# Altium project CMTestBoard.PrjPcb (part 2 of 2)

## Sheet STM32F4.SchDoc
size Letter
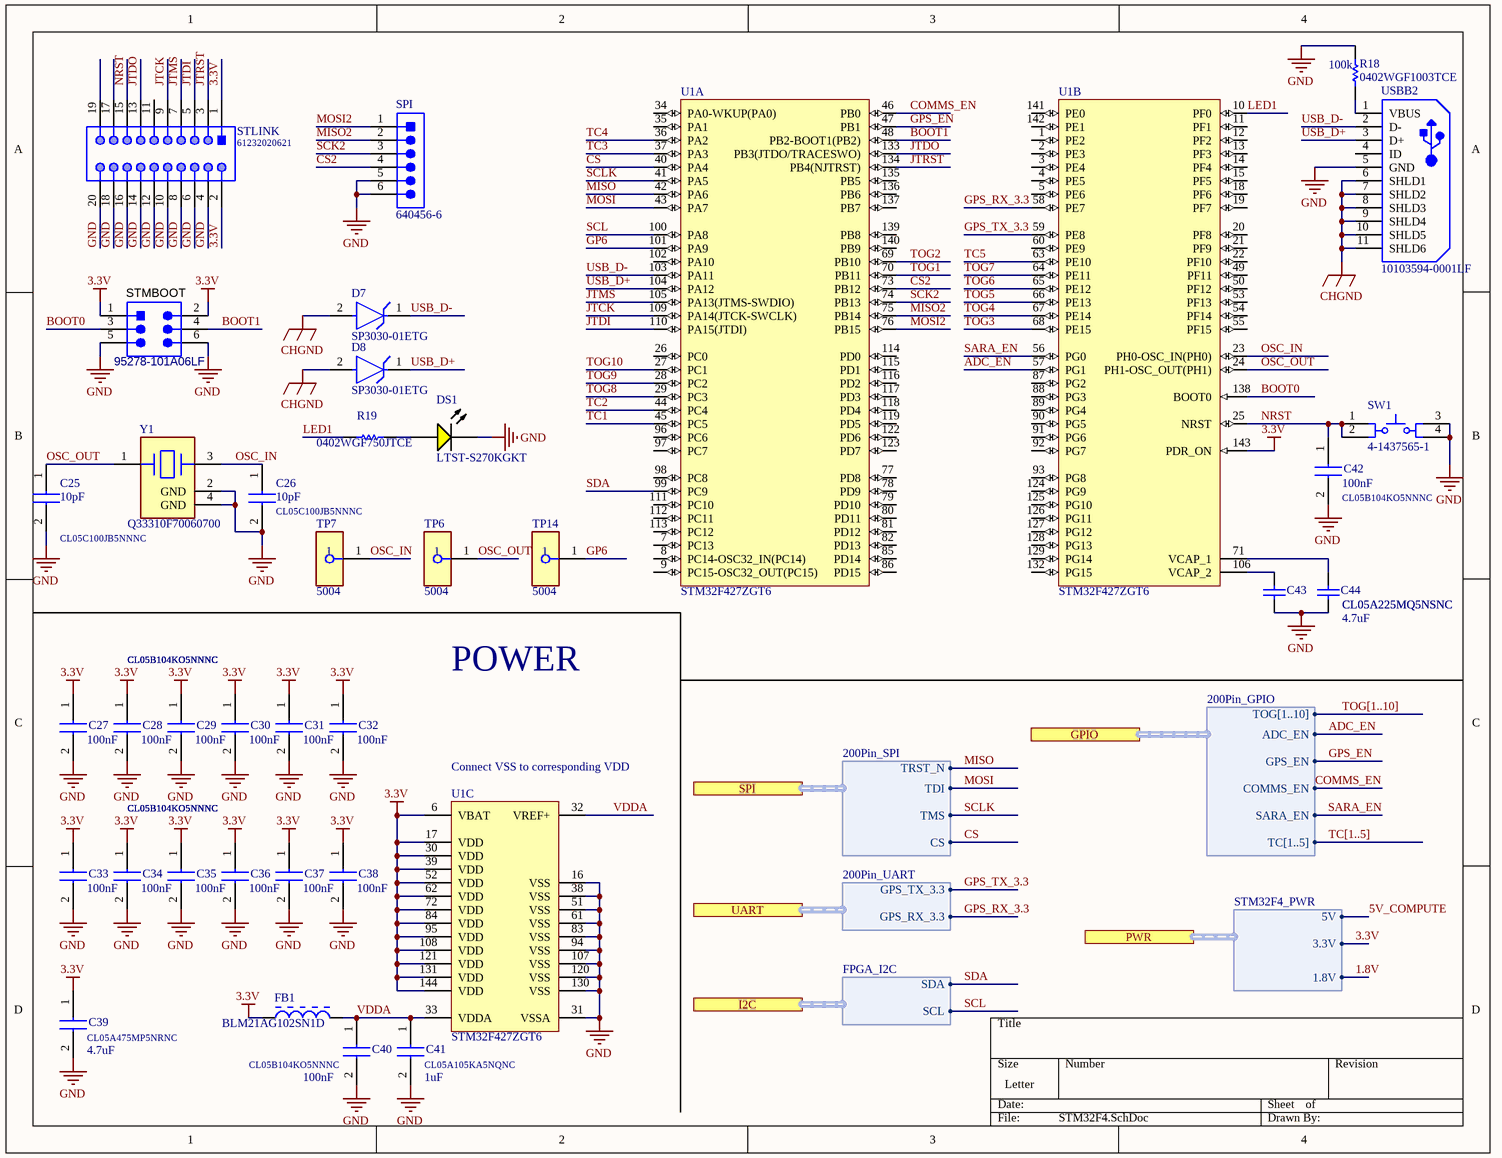
[diagram p4: STM32F4.SchDoc]

### Parts
(Parts that share a designator on the sheet are numbered #1, #2 ... from top to bottom, then left to right.)
C25#2  CL05C100JB5NNNC  value 10pF  [CAPC1005X55N]
C26#2  CL05C100JB5NNNC  value 10pF  [CAPC1005X55N]
C27#2  CL05B104KO5NNNC  value 100nF  [CAPC1005X55N]
C28#2  CL05B104KO5NNNC  value 100nF  [CAPC1005X55N]
C29  CL05B104KO5NNNC  value 100nF  [CAPC1005X55N]
C30  CL05B104KO5NNNC  value 100nF  [CAPC1005X55N]
C31  CL05B104KO5NNNC  value 100nF  [CAPC1005X55N]
C32  CL05B104KO5NNNC  value 100nF  [CAPC1005X55N]
C33  CL05B104KO5NNNC  value 100nF  [CAPC1005X55N]
C34  CL05B104KO5NNNC  value 100nF  [CAPC1005X55N]
C35  CL05B104KO5NNNC  value 100nF  [CAPC1005X55N]
C36  CL05B104KO5NNNC  value 100nF  [CAPC1005X55N]
C37  CL05B104KO5NNNC  value 100nF  [CAPC1005X55N]
C38  CL05B104KO5NNNC  value 100nF  [CAPC1005X55N]
C39  CL05A475MP5NRNC  value 4.7uF  [CAPC1005X55N]
C40  CL05B104KO5NNNC  value 100nF  [CAPC1005X55N]
C41  CL05A105KA5NQNC  value 1uF  [CAPC1005X55N]
C42  CL05B104KO5NNNC  value 100nF  [CAPC1005X55N]
C43  CL05A225MQ5NSNC  [0402]
C44  CL05A225MQ5NSNC  [0402]
D7  SP3030-01ETG  [FP-SP3030-MFG]
D8  SP3030-01ETG  [FP-SP3030-MFG]
DS1#2  LTST-S270KGKT  [AVAG-HSMX-C190_V]
FB1  BLM21AG102SN1D  [MURA-BLM21-H1-CHIP-2_V]
R18  0402WGF1003TCE  [0402]
R19  0402WGF750JTCE  [RESC1005X40X25ML05T10]
SPI  640456-6  [TECO-640456-6_V]
STLINK  61232020621  [61232020621]
STMBOOT  95278-101A06LF  [AMPM-95278-101A06LF_V]
SW1#2  4-1437565-1  [TECO-4-1437565-1_V]
TP6#2  5004  [FP-5004-MFG]
TP7#2  5004  [FP-5004-MFG]
TP14  5004  [FP-5004-MFG]
U1#2  STM32F427ZGT6  [STM-LQFP144_V]  (parts A,B,C of 3)
USBB2  10103594-0001LF  [FCI-10103594-0001LF_V]
Y1  Q33310F70060700  [FP-7M-MFG]

### Ports
GPIO (harness 200Pin_GPIO), I2C (harness FPGA_I2C), PWR (harness STM32F4_PWR), SPI (harness 200Pin_SPI), UART (harness 200Pin_UART)

### Harnesses
STM32F4_PWR: 5V, 3.3V, 1.8V
FPGA_I2C: SDA, SCL
200Pin_UART: GPS_TX_3.3, GPS_RX_3.3
200Pin_SPI: TRST_N, TDI, TMS, CS
200Pin_GPIO: TOG[1..10], ADC_EN, GPS_EN, COMMS_EN, SARA_EN, TC[1..5]

### Nets
3.3V: C27#2.1 C28#2.1 C29.1 C30.1 C31.1 C32.1 C33.1 C34.1 C35.1 C36.1 C37.1 C38.1 C39.1 FB1.1 STLINK.1 STLINK.2 STMBOOT.1 STMBOOT.2 U1#2.6(VBAT) U1#2.17(VDD) U1#2.30(VDD) U1#2.39(VDD) U1#2.52(VDD) U1#2.62(VDD) U1#2.72(VDD) U1#2.84(VDD) U1#2.95(VDD) U1#2.108(VDD) U1#2.121(VDD) U1#2.131(VDD) U1#2.143(PDR_ON) U1#2.144(VDD) ; port PWR.3.3V
CHGND: D7.2(A) D8.2(A) USBB2.6(SHLD1) USBB2.7(SHLD2) USBB2.8(SHLD3) USBB2.9(SHLD4) USBB2.10(SHLD5) USBB2.11(SHLD6)
GND: C25#2.2 C26#2.2 C27#2.2 C28#2.2 C29.2 C30.2 C31.2 C32.2 C33.2 C34.2 C35.2 C36.2 C37.2 C38.2 C39.2 C40.2 C41.2 C42.2 C43.1 C44.1 DS1#2.2(K) R18.2 SPI.5 SPI.6 STLINK.4 STLINK.6 STLINK.8 STLINK.10 STLINK.12 STLINK.14 STLINK.16 STLINK.18 STLINK.20 STMBOOT.5 STMBOOT.6 SW1#2.3 SW1#2.4 U1#2.16(VSS) U1#2.31(VSSA) U1#2.38(VSS) U1#2.51(VSS) U1#2.61(VSS) U1#2.83(VSS) U1#2.94(VSS) U1#2.107(VSS) U1#2.120(VSS) U1#2.130(VSS) USBB2.5(GND) Y1.2(GND) Y1.4(GND)
ADC_EN: U1#2.57(PG1) ; port GPIO.ADC_EN
BOOT0: STMBOOT.3 U1#2.138(BOOT0)
BOOT1: STMBOOT.4 U1#2.48(PB2-BOOT1(PB2))
COMMS_EN: U1#2.46(PB0) ; port GPIO.COMMS_EN
CS: U1#2.40(PA4) ; port SPI.CS
CS2: SPI.4 U1#2.73(PB12)
GP6: TP14.1 U1#2.101(PA9)
GPS_EN: U1#2.47(PB1) ; port GPIO.GPS_EN
GPS_RX_3.3: U1#2.58(PE7) ; port UART.GPS_RX_3.3
GPS_TX_3.3: U1#2.59(PE8) ; port UART.GPS_TX_3.3
JTCK: STLINK.9 U1#2.109(PA14(JTCK-SWCLK))
JTDI: STLINK.5 U1#2.110(PA15(JTDI))
JTDO: STLINK.13 U1#2.133(PB3(JTDO/TRACESWO))
JTMS: STLINK.7 U1#2.105(PA13(JTMS-SWDIO))
JTRST: STLINK.3 U1#2.134(PB4(NJTRST))
LED1: R19.2 U1#2.10(PF0)
MISO: U1#2.42(PA6) ; port SPI.TRST_N
MISO2: SPI.2 U1#2.75(PB14)
MOSI: U1#2.43(PA7) ; port SPI.TDI
MOSI2: SPI.1 U1#2.76(PB15)
NRST: C42.1 STLINK.15 SW1#2.1 SW1#2.2 U1#2.25(NRST)
OSC_IN: C26#2.1 TP7#2.1 U1#2.23(PH0-OSC_IN(PH0)) Y1.3
OSC_OUT: C25#2.1 TP6#2.1 U1#2.24(PH1-OSC_OUT(PH1)) Y1.1
SARA_EN: U1#2.56(PG0) ; port GPIO.SARA_EN
SCK2: SPI.3 U1#2.74(PB13)
SCL: U1#2.100(PA8) ; port I2C.SCL
SCLK: U1#2.41(PA5) ; port SPI.TMS
SDA: U1#2.99(PC9) ; port I2C.SDA
TC1: U1#2.45(PC5)
TC2: U1#2.44(PC4)
TC3: U1#2.37(PA3)
TC4: U1#2.36(PA2)
TC5: U1#2.63(PE10)
TOG1: U1#2.70(PB11)
TOG2: U1#2.69(PB10)
TOG3: U1#2.68(PE15)
TOG4: U1#2.67(PE14)
TOG5: U1#2.66(PE13)
TOG6: U1#2.65(PE12)
TOG7: U1#2.64(PE11)
TOG8: U1#2.29(PC3)
TOG9: U1#2.28(PC2)
TOG10: U1#2.27(PC1)
USB_D+: D8.1(C) U1#2.104(PA12) USBB2.3(D+)
USB_D-: D7.1(C) U1#2.103(PA11) USBB2.2(D-)
VDDA: C40.1 C41.1 FB1.2 U1#2.32(VREF+) U1#2.33(VDDA)
NetC43_2: C43.2 U1#2.106(VCAP_2)
NetC44_2: C44.2 U1#2.71(VCAP_1)
NetDS1#2_1: DS1#2.1(A) R19.1
NetR18_1: R18.1 USBB2.1(VBUS)

Not connected (* = marked no-connect by the designer): STLINK 11 17 19; U1#2 1(PE2) 2(PE3) 3(PE4) 4(PE5) 5(PE6) 7(PC13) 8(PC14-OSC32_IN(PC14)) 9(PC15-OSC32_OUT(PC15)) 11(PF1) 12(PF2) 13(PF3) 14(PF4) 15(PF5) 18(PF6) 19(PF7) 20(PF8) 21(PF9) 22(PF10) 26(PC0) 34(PA0-WKUP(PA0)) 35(PA1) 49(PF11) 50(PF12) 53(PF13) 54(PF14) 55(PF15) 60(PE9) 77(PD8) 78(PD9) 79(PD10) 80(PD11) 81(PD12) 82(PD13) 85(PD14) 86(PD15) 87(PG2) 88(PG3) 89(PG4) 90(PG5) 91(PG6) 92(PG7) 93(PG8) 96(PC6) 97(PC7) 98(PC8) 102(PA10) 111(PC10) 112(PC11) 113(PC12) 114(PD0) 115(PD1) 116(PD2) 117(PD3) 118(PD4) 119(PD5) 122(PD6) 123(PD7) 124(PG9) 125(PG10) 126(PG11) 127(PG12) 128(PG13) 129(PG14) 132(PG15) 135(PB5) 136(PB6) 137(PB7) 139(PB8) 140(PB9) 141(PE0) 142(PE1); USBB2 4(ID)

### Buses and harness runs
bus TC[1..5]
bus TOG[1..10]

### Notes on the sheet
- (near R18) 100k
- (near C44) 4.7uF
- POWER
- (near U1#2) Connect VSS to corresponding VDD

### Library data of the parts
C25#2 C26#2 C27#2 C28#2 C29-C42 = C0402C560K5RACTU: 100nF 0402; Manufacturer_Name: Kemet; Datasheet Link: https://content.kemet.com/datasheets/KEM_C1002_X7R_SMD.pdf; Height: 0.55mm; Manufacturer_Part_Number: C0402C560K5RACTU; Arrow Part Number: C0402C560K5RACTU; Mouser Part Number: 80-C0402C560K5RACTU; Mouser Price/Stock: https://www.mouser.co.uk/ProductDetail/KEMET/C0402C560K5RACTU?qs=gt1LBUVyoHmQZW5v3ySgNQ%3D%3D
C43 C44 = Cap: 2.2uF 0402; Published: 8-Jun-2000; LatestRevisionDate: 17-Jul-2002; LatestRevisionNote: Re-released for DXP Platform.; PackageReference: RAD-0.3; Publisher: Altium Limited; PackageDescription: Radial Cap, Thru-Hole; 2 Leads; 0.3 in Pin Spacing
D7 D8 = CMP-08607-000070-1: TVS DIODE 5V 10V SOD882; Manufacturer: Littelfuse; Max Junction Temp: +150°C; Automotive Grade: Grade 1; Direction: Unidirectional; Peak Pulse Current: 3A; Capacitance: 0.5pF; Value: 0.5pF; Number Of Channels: 1; Manufacturer Part Number: SP3030-01ETG; Temperature Range Low: -40°C; Lead Free: Yes; Package: SP3030; Device Class L2: TVS Diodes; Height: 0.6mm; ComponentLink2URL: https://www.littelfuse.com/~/media/electronics/datasheets/tvs_diode_arrays/littelfuse_tvs_diode_array_sp3030_datasheet.pdf.pdf; Device Class L3: unset; Category: Diode; Reverse Standoff Voltage: 5V; RoHS: TRUE; Digikey Description: TVS DIODE 5V 10V SOD882; Octopart: https://octopart.com/sp3030-01etg-littelfuse-29687287; ComponentLink2Description: Datasheet; Device Class L1: Circuit Protection; Automotive: Yes; Temperature: -40°C to +125°C; Temperature Range High: +125°C; Clamping Voltage: 10V; Mouser Description: TVS Diodes / ESD Suppressors 5V 1uA 22kV UNIDIRECTIONAL
DS1#2 = CMP-1744-00003-1: LED Uni-Color Yellow, 65 mW, 20 mA, -40 to 85 degC, 2-Pin SMD, RoHS, Tape and Reel; Tolerance: 1%; Voltage Rating: 50 V; Power Rating: 100 mW; Case\Package: 0603; Resistance: 390 Ohm; Min Operating Temperature: -55 degC; Length: 1.6 mm; ComponentLink3Description: Package Specification; Mount: Surface Mount; PackageReference: HSMX-C190; ComponentLink2Description: Datasheet; DatasheetVersion: Mar-12; Case Code (Metric): 1608; Pins: 2; Package Quantity: 5000; ComponentLink2URL: http://docs.avagotech.com/docs/AV02-0551EN; ComponentLink1Description: Manufacturer URL; RoHSCompliant: true; Packaging: Tape and Reel; PackageDescription: 2-Pin Surface Mount Device, Body 1.6 x 0.8 mm, Height 0.9 mm; REACH SVHC: No SVHC; ComponentLink3URL: http://www.fairchildsemi.com/dwg/MA/MA03D.pdf; Voltage Rating (DC): 50 V; Width: 0.8 mm; ComponentLink1URL: http://www.avagotech.com/; Max Operating Temperature: 155 degC; Case Code (Imperial): 0603; Height: 0.45 mm
FB1 = CMP-0686-00665-2: Chip Ferrite Bead for General Signal lines, 1000 Ohm, 500 mA, -55 to 125 degC, 2 x 1.25 x 1.05 mm SMD, Tape and Reel; Manufacturer: Murata; Impedance (at 100 MHz): 1000 Ohm +/- 25%; DC Resistance: 0.28 Ohm Max.; Rated Current: 500 mA; ComponentLink1Description: Manufacturer URL; PackageDescription: 2-Pin Chip, Body 2 x 1.25 mm; DatasheetVersion: 08/2013; PartNumber: BLM21AG102SN1D; Mounting Technology: Surface Mount; Operating Temperature Range: -55 to 125 degC; ComponentLink2URL: http://www.murata.com/products/catalog/pdf/c31e.pdf; ComponentLink3Description: Package Specification; ComponentLink2Description: Datasheet; Packing: Tape and Reel; ComponentLink3URL: http://www.murata.com/products/catalog/pdf/c31e.pdf; ComponentLink1URL: http://www.murata.com/; PackageReference: BLM21_H1050-2
R18 = Res1: 100k 0402; Published: 8-Jun-2000; LatestRevisionDate: 17-Jul-2002; LatestRevisionNote: Re-released for DXP Platform.; PackageReference: AXIAL-0.3; Publisher: Altium Limited; PackageDescription: Axial Device, Thru-Hole; 2 Leads; 0.3 in Pin Spacing
R19 = CMP-2002-07344-1: 75R 0402; Part Number: RC0402FR-07100RL; Manufacturer: Yageo / Phycomp
SPI = CMP-2000-05661-1: Male Header, Pitch 2.54 mm, 1 x 6 Position, Height 10.03 mm, Tail Length 3.56 mm, -55 to 105 degC, Bulk; Manufacturer: TE Connectivity; Contact Centerline Spacing: 0.100 / in.; Number of Contacts: 6; Current, Rating: 5 / A; Agency Approvals: CSA,UL; Material, Contact: CopperAlloy; Mounting Hole Size: 0.04 / "; Brand/Series: MTA-100Series; Pin Spacing: 0.1 / "; Mount Angle: Vertical; Contact Termination Area Plating: Tin; Angle: Straight; Primary Type: InterconnectSystem; Standards: RoHSCompliant,ELVCompliant,UL94V-0; Temperature, Operating: -55to+105 / °C; Material, Housing: Polyester; Special Features: Pinstrip; Color, Housing: White; Connector Type: MTA-100; Voltage, Rating: 250 / V; Termination: Solder; Package Reference: 640456-6; Size, Post: 0.025 / in.; Color: White; Datasheet URL: https://datasheet.ciiva.com/25618/0900766b80eb7fdd-25618163.pdf; Manufacturer URL: http://www.te.com/; Mounting Type: PCMount; Length, Pin: 0.14 / "; Type: PCBPlug; Length, Overall: 0.6 / "; Mounting Technology: ThroughHole; Number of Rows: 1; Contact Shape: Square; Contact Mating Area Plating: Tin; Datasheet Version: Rev. W, 05/2005; Number of Positions: 6; Package Description: Male Header, Pitch 2.54 mm, 1 x 6 Position, Height 10.03 mm, Tail Length 3.56 mm; Contact Plating: Tin; Length, Terminal Post: 0.14 / in.; Flammability Rating: UL94V-0
STLINK = CMP-1502-00063-1: Male Box Header WR-BHD, SMT, Vertical, pitch 2.54 mm, 20 pins; Manufacturer: Wurth Elektronik; Withstanding Voltage: 500VAC; Working Voltage: 250VAC; Pin Number: 20; Contact Resistance: 20mOhm; Pitch: 2.54mm; Datasheet URL: https://katalog.we-online.de/em/datasheet/6123xx20621.pdf; Gender: Male; Packaging: TapeandReel; Operating Temperature: -40to125degC; Mounting Technology: SMT; Orientation: Vertical; Published Date: August2018; Part Number: 61232020621; Manufacturer URL: http://www.we-online.de; Package Reference: 61232020621; Publisher: WurthElektronik
STMBOOT = CMP-1743-00002-1: Male Header, Pitch 2.54 mm, 2 x 3 Position, Height 14.4 mm, RoHS, Tape and Reel; Power Rating: 100 mW; Tolerance: 1%; Resistance: 49.9 Ohm; Case\Package: 0603; Voltage Rating: 50 V; DatasheetVersion: Rev. AC, 03/2016; PackageDescription: Male Header, Pitch 2.54 mm, 2 x 3 Position, Height 14.4 mm; REACH SVHC: No SVHC; Height: 0.45 mm; Mount: Surface Mount; Case Code (Imperial): 0603; Max Operating Temperature: 155 degC; Case Code (Metric): 1608; Packaging: Tape and Reel; RoHSCompliant: true; ComponentLink1Description: Datasheet; Min Operating Temperature: -55 degC; Length: 1.6 mm; Width: 0.8 mm; ComponentLink1URL: http://portal.fciconnect.com/Comergent//fci/drawing/95278.pdf; PackageReference: 95278-101A06LF
SW1#2 = CMP-2000-05602-1: Tactile Switch, 50 mA, 12 VDC, -20 to 85 degC, 4-Pin SMD, RoHS, Bulk; Manufacturer: TEConnectivity/AMPBrand; Illumination Type: N/R; Maximum Contact Resistance: 100mOhm; Actuator Style: RoundButton; Actuator Length: 1.4mm; Contact Rating @ Voltage: 0.05@12VDCA; Maximum DC Voltage Rating: 12V; Body Orientation: Straight; Ground Terminal: No; Dielectric Strength: 500VAC; Operating Force: 1.57N; Electrical Life: 100000Cycle; Mechanical Life: N/A; Family: FSMJSMA; Contact Material: CopperAlloy; Type: N/A; RoHS: Yes; Pole Throw Configuration: N/A; Operating Temperature: -20to85C; Minimum Insulation Resistance: 100MOhm; Package Description: 4-Pin Surface Mount Device, Body 6 x 6 mm, Pitch 9.1 mm; Housing Material: N/A; Switch Configuration: N/A; Mounting: SurfaceMount,GullWing; Datasheet URL: https://datasheet.ciiva.com/14635/0900766b80912216-14635826.pdf; Packaging: Bulk; Base Material: N/A; Actuator Color: N/A; Dimension: 6x10x5.25mm; Contact Plating: Silver; Seal Location: N/A; Mounting Technology: SurfaceMount; Part No: 4-1437565-1; Seal Description: N/A; Maximum AC Voltage Rating: N/A; Datasheet Version: 04/2007; Manufacturer URL: http://www.te.com/; Package Reference: 4-1437565-1; Product Weight: N/A
TP6#2 TP7#2 TP14 = CMP-2000-05575-2: PC TEST POINT MINIATURE YELLOW; Manufacturer: Keystone; Number Of Contacts: 1; Is Female: yes; Device Class L1: Connectors; Manufacturer Part Number: 5004; Digikey Description: PC TEST POINT MINIATURE YELLOW; ComponentLink2URL: https://www.keyelco.com/product-pdf.cfm?p=1313; Lead Free: Yes; ComponentLink2Description: Datasheet; Category: Conn; Height: 4.72mm; Octopart: https://octopart.com/5004-keystone-28591; Mouser Description: TEST POINT PC MINI .040"D YELLOW; Device Class L3: unset; Contact Material: Silver; Package: 5004; Automotive: No; Device Class L2: unset; RoHS: TRUE
U1#2 = CMP-0243-00054-2: ARM Cortex-M4 32-bit MCU+FPU, 210 DMIPS, 1024 kB Flash, 256 kB Internal RAM, 114 I/Os, 144-pin LQFP, -40 to 85 degC, Tray; Manufacturer: STMicroelectronics; I/Os (High Current): 114; Supply Voltage(Vcc) max (V): 3.6; FLASH Size (Prog) (kB): 1024; Supply Voltage(Vcc) min (V): 1.8; Internal RAM Size (kB): 256; D/A Converter: 2x12-bit; Operating Frequency(F) (Processor speed) (MHz): 168; Packing: Tray; ComponentLink2URL: http://www.st.com/st-web-ui/static/active/en/resource/technical/document/datasheet/DM00071990.pdf; ComponentLink2Description: Datasheet; ComponentLink3URL: http://www.st.com/st-web-ui/static/active/en/resource/technical/document/datasheet/DM00037051.pdf; ComponentLink1Description: Manufacturer URL; PackageReference: LQFP144; Core: ARM Cortex-M4; ComponentLink1URL: http://www.st.com/web/en/home.html; PackageDescription: 144-Pin Low Profile Quad Flat Package, 20 x 20 mm Body, 0.5 mm Pitch; Mounting Technology: Surface Mount; ComponentLink3Description: Package Specification; PackageVersion: Rev. 4, 06/2013; DatasheetVersion: Rev. 1; PartNumber: STM32F427ZGT6
USBB2 = CMP-1698-00007-1: Micro USB 2.0 B Receptacle, -55 to 85 degC, 5-Pin SMD, RoHS, Tape and Reel; Type (Resistor): Thick Film; Case\Package: 0603; Resistance: 4.7 kohm; Tolerance: 1%; Voltage Rating: 75 V; Power Rating: 100 mW; Case Code (Imperial): 0603; Case Code (Metric): 1608; REACH SVHC: Unknown; ComponentLink1URL: http://portal.fciconnect.com/; Package Quantity: 5000; RoHSCompliant: true; Max Operating Temperature: 155 degC; Min Operating Temperature: -55 degC; Mount: Surface Mount; Weight: 7.1E-05 oz; Length: 1.55 mm; PackageDescription: 5-Pin Surface Mount Device, Body 8.04 x 5.62 mm; Pins: 2; Height: 0.45 mm; ComponentLink2Description: Datasheet; ComponentLink2URL: http://portal.fciconnect.com/Comergent//fci/drawing/10103594.pdf; PackageReference: FCI-10103594-0001LF; DatasheetVersion: Rev. A, 06/2010; Width: 0.85 mm; Packaging: Tape and Reel; ComponentLink1Description: Manufacturer URL; LCSC Part #: *
Y1 = CMP-18717-000014-1: CRYSTAL 12.0000MHZ 15PF SMD; Load Capacitance: 12pF; Frequency Tolerance: 30ppm; Frequency: 32MHz; ESR (Equivalent Series Resistance): 60R; Max Operating Temperature: 85°C; Case/Package: SMD/SMT; Min Operating Temperature: -40°C; Mount: Surface Mount; Packaging: Tape and Reel; Frequency Stability: 30ppm; Width: 0.098inch; Length: 0.126inch; Package Quantity: 1; Lead Free: Lead Free; Height: 0.031inch

## Nets that join several sheets
1.8V: 200PinConnector (5 pins), CMPower (9 pins), Peripherals (R12#1.2 R16#1.1)
3.3V: 200PinConnector (14 pins), CMPower (9 pins), Peripherals (5 pins), XC95144XL (20 pins), STM32F4 (32 pins)
5V: 200PinConnector (5 pins), CMPower (16 pins), Peripherals (C23#1.1 SJ2.2 U6.3)
CHGND: 200PinConnector (U7.2 U8.2 U9.2), Peripherals (22 pins), STM32F4 (8 pins)
GND: 200PinConnector (71 pins), CMPower (26 pins), Peripherals (19 pins), XC95144XL (34 pins), STM32F4 (50 pins)
ADC_EN: 200PinConnector (J1.47), XC95144XL (U1#1.94), STM32F4 (U1#2.57)
COMMS_EN: 200PinConnector (J1.59), XC95144XL (U1#1.89), STM32F4 (U1#2.46)
CS: 200PinConnector (J1.58), XC95144XL (U1#1.86), STM32F4 (U1#2.40)
EMMC_DISABLE_IN: 200PinConnector (J1.2), Peripherals (Q1.3)
EMMC_EN_N1.8V: 200PinConnector (J1.90), Peripherals (Q2.1 R12#1.1)
GPS_EN: 200PinConnector (J1.57), XC95144XL (U1#1.90), STM32F4 (U1#2.47)
GPS_RX_3.3: 200PinConnector (J1.53), XC95144XL (U1#1.91), STM32F4 (U1#2.58)
GPS_TX_3.3: 200PinConnector (J1.51), XC95144XL (U1#1.92), STM32F4 (U1#2.59)
HDMI_CEC: 200PinConnector (J1.171), Peripherals (Q4.3 R17.1)
HDMI_CLK_N: 200PinConnector (J1.111), Peripherals (HDMIPORT.12)
HDMI_CLK_P: 200PinConnector (J1.113), Peripherals (HDMIPORT.10)
HDMI_D0_N: 200PinConnector (J1.117), Peripherals (HDMIPORT.9)
HDMI_D0_P: 200PinConnector (J1.119), Peripherals (HDMIPORT.7)
HDMI_D1_N: 200PinConnector (J1.123), Peripherals (HDMIPORT.6)
HDMI_D1_P: 200PinConnector (J1.125), Peripherals (HDMIPORT.4)
HDMI_D2_N: 200PinConnector (J1.129), Peripherals (HDMIPORT.3)
HDMI_D2_P: 200PinConnector (J1.131), Peripherals (HDMIPORT.1)
HDMI_HPD_N_1V8: 200PinConnector (J1.88), Peripherals (Q5.3 R16#1.2)
HDMI_SCL: 200PinConnector (J1.175), Peripherals (HDMIPORT.15 R21.1 U14.5)
HDMI_SDA: 200PinConnector (J1.173), Peripherals (HDMIPORT.16 R20.1 U14.4)
MISO: 200PinConnector (J1.60), XC95144XL (U1#1.85), STM32F4 (U1#2.42)
MOSI: 200PinConnector (J1.64), XC95144XL (U1#1.80), STM32F4 (U1#2.43)
RUN: 200PinConnector (J1.177 U9.4), Peripherals (JTAG.1)
SARA_EN: 200PinConnector (J1.48), XC95144XL (U1#1.93), STM32F4 (U1#2.56)
SCL: 200PinConnector (J1.5 R6.2), XC95144XL (U1#1.16), STM32F4 (U1#2.100)
SCLK: 200PinConnector (J1.66), XC95144XL (U1#1.79), STM32F4 (U1#2.41)
SDA: 200PinConnector (J1.3 R5.2), XC95144XL (U1#1.17), STM32F4 (U1#2.99)
TC1: 200PinConnector (J1.63), XC95144XL (U1#1.82), STM32F4 (U1#2.45)
TC2: 200PinConnector (J1.65), XC95144XL (U1#1.81), STM32F4 (U1#2.44)
TC3: 200PinConnector (J1.81), XC95144XL (U1#1.73), STM32F4 (U1#2.37)
TC4: 200PinConnector (J1.87), XC95144XL (U1#1.72), STM32F4 (U1#2.36)
TC5: 200PinConnector (J1.29), XC95144XL (U1#1.7), STM32F4 (U1#2.63)
TCK: 200PinConnector (J1.180 U8.3), Peripherals (JTAG.8)
TDI: 200PinConnector (J1.174 U9.6), Peripherals (JTAG.3)
TDO: 200PinConnector (J1.178 U8.1), Peripherals (JTAG.5)
TMS: 200PinConnector (J1.176 U8.4), Peripherals (JTAG.6)
TOG1: 200PinConnector (J1.9), XC95144XL (U1#1.14), STM32F4 (U1#2.70)
TOG2: 200PinConnector (J1.11), XC95144XL (U1#1.13), STM32F4 (U1#2.69)
TOG3: 200PinConnector (J1.15), XC95144XL (U1#1.12), STM32F4 (U1#2.68)
TOG4: 200PinConnector (J1.17), XC95144XL (U1#1.11), STM32F4 (U1#2.67)
TOG5: 200PinConnector (J1.21), XC95144XL (U1#1.10), STM32F4 (U1#2.66)
TOG6: 200PinConnector (J1.23), XC95144XL (U1#1.9), STM32F4 (U1#2.65)
TOG7: 200PinConnector (J1.27), XC95144XL (U1#1.8), STM32F4 (U1#2.64)
TOG8: 200PinConnector (J1.78), XC95144XL (U1#1.76), STM32F4 (U1#2.29)
TOG9: 200PinConnector (J1.76), XC95144XL (U1#1.77), STM32F4 (U1#2.28)
TOG10: 200PinConnector (J1.72), XC95144XL (U1#1.78), STM32F4 (U1#2.27)
TRST_N: 200PinConnector (J1.172 U9.5), Peripherals (JTAG.2)
USB_DM: 200PinConnector (J1.167), Peripherals (IC2.4)
USB_DP: 200PinConnector (J1.165), Peripherals (IC2.3)